# Altium schematic sheet LED_Port.SchDoc: LED_Port
size A4
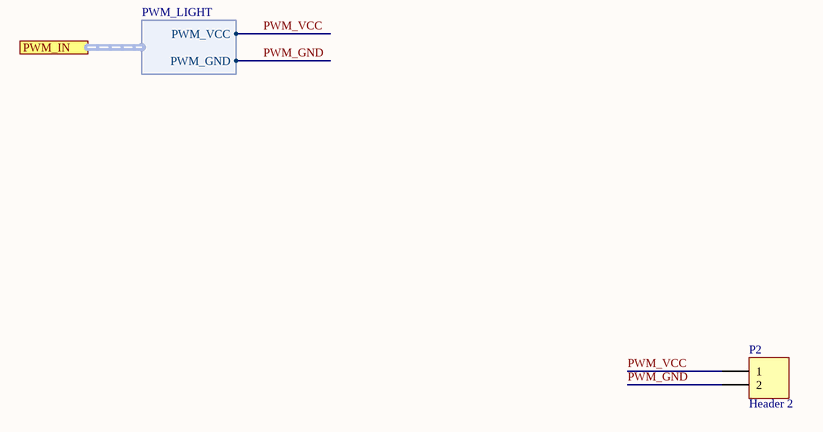
[diagram p0: LED_Port.SchDoc]

## Parts
P2  Header 2  [CCM-5.08-2P]

## Ports
PWM_IN (harness PWM_LIGHT)

## Harnesses
PWM_LIGHT: PWM_VCC, PWM_GND

## Nets
PWM_GND: P2.2 ; port PWM_IN.PWM_GND
PWM_VCC: P2.1 ; port PWM_IN.PWM_VCC

## Library data of the parts
P2 = Header 2: Header, 2-Pin; LatestRevisionDate: 17-Jul-2002; LatestRevisionNote: Re-released for DXP Platform.; Publisher: Altium Limited